# EAGLE design rs485board (EAGLE 7.6.0)
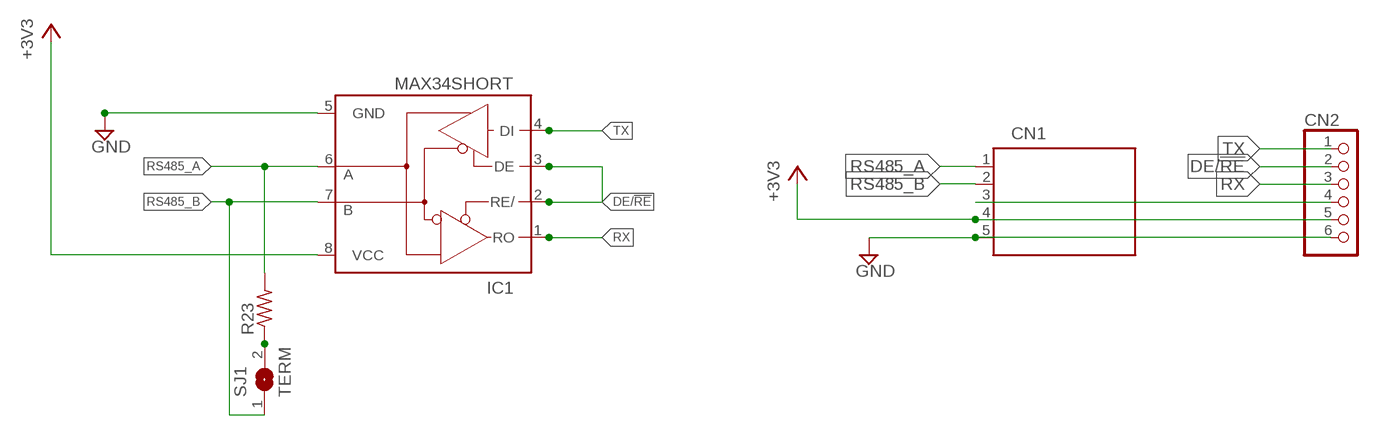
[diagram p0: schematic, sheet 1]

## Parts
CN1  5PINZH  [ZH-5]
CN2  PINHD-1X06_2.54  [1X06]
IC1  MAX34SHORT  [SO08SHORT]
R23  R-US_R0603  [R0603]
SJ1  TERM  SJ  [SJ]

## Nets
+3V3RS485: CN1.4 CN2.5 IC1.8(VCC) ; supply symbol labelled +3V3
DE/!RE: CN2.2 IC1.2(RE/) IC1.3(DE)
GND: CN1.5 CN2.6 IC1.5(GND)
N$44: R23.1 SJ1.2
N$45: CN1.3 CN2.4
RS485_A: CN1.1 IC1.6(A) R23.2
RS485_B: CN1.2 IC1.7(B) SJ1.1
RX: CN2.3 IC1.1(RO)
TX: CN2.1 IC1.4(DI)

## Library data of the parts
CN1 = con-jst:5PIN
CN2 = pinhead-2:PINHD-1X06: PIN HEADER
IC1 = maxim:MAX34*: +5V, Fail-Safe, 40Mbps, Profibus RS-485/RS-422 Transceivers Source: MAX3465-MAX3469.pdf
R23 = rcl:R-US_: RESISTOR, American symbol
SJ1 = jumper:SJ: SMD solder JUMPER

## Board
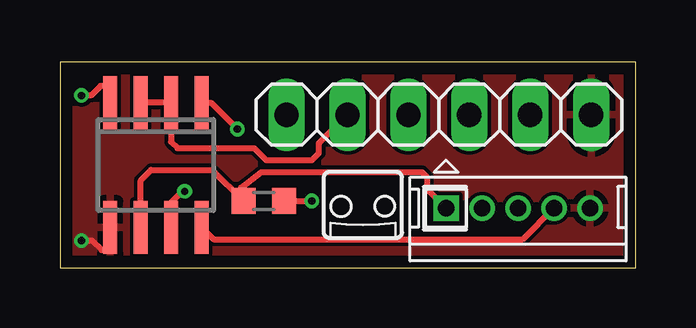
[diagram p1: board, top side]
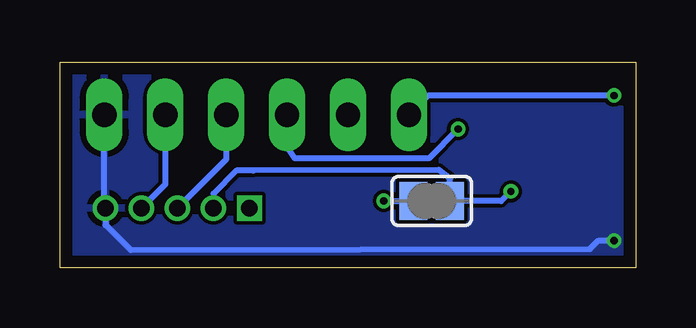
[diagram p2: board, bottom side, seen from below]

Size 24 x 8.6 mm. Coordinates in mm from the lower left corner, seen from the top.
Outline: 0,8.6 0,0 24,0 24,8.6 0,8.6
Copper layers (1*16): Top 0.035mm / dielectric 1.6mm / Bottom 0.035mm
Design rules "Elecrow_2-layer_PCB_eagle_rule": minimum track width 6mil, minimum drill 12mil, track to track 6mil, track to pad 6mil, pad to pad 6mil, via to via 8mil, smd to smd 0mil, copper to edge 20mil, drill to drill 10mil, minimum pad ring 6mil, minimum via ring 6mil, stop-mask expansion 0mil, vias tented up to drill 100mil, thermal gap 10mil

### Footprints (pad centres in the part's own frame; a part is rotated, then mirrored left to right if it is on the bottom)
ZH-5 = drill 0.7 square: 1 -4.5,0 | drill 0.7: 2 -3,0; 3 -1.5,0; 4 0,0; 5 1.5,0
1X06 = drill 1.016 long: 1 -6.35,0; 2 -3.81,0; 3 -1.27,0; 4 1.27,0; 5 3.81,0; 6 6.35,0
SO08SHORT = smd 0.6 x 2.2: 1 -1.905,-2.6; 2 -0.635,-2.6; 3 0.635,-2.6; 4 1.905,-2.6; 5 1.905,2.6; 6 0.635,2.6; 7 -0.635,2.6; 8 -1.905,2.6
R0603 = smd 1 x 1.1: 1 -0.85,0; 2 0.85,0
SJ = smd 1.168 x 1.6: 1 -0.762,0; 2 0.762,0

### Placement (x,y rotation side)
CN1  20.6,2.5 0 top
CN2  15.8,6.4 0 top
IC1  4,4.3 180 top
R23  8.5,2.8 180 top
SJ1  8.5,2.8 180 bottom
U$3  [PLENLOGO]  11,1.5 0 top

### Tracks (layer width: path | path; a pad name or v marks a point on that pad's centre or on a via)
+3V3RS485
  Top 0.254: CN1.4 19.3,1.2 6.41,1.2 IC1.8
  Bottom 0.254: CN2.5 19.61,3.49 CN1.4
DE/!RE
  Top 0.254: IC1.3 IC1.2 4.63,5.26 4.9,5 8.1,5 8.6,4.5 10.5,4.5 10.8,4.8 10.8,5.21 CN2.2
GND  (via drill 0.3)
  Top 0.254: v0.9,1.15 1.33,1.15 1.73,0.75 2.1,0.75 IC1.5
  Bottom 0.254: v0.9,1.15 1.55,1.15 1.9,0.8 21.05,0.75 22.1,1.8 CN1.5 22.15,2.5 CN2.6
  pour Top: 0,0 24,0 24,8.6 0,8.6
  pour Bottom: 0,0 24,0 24,8.6 0,8.6
N$44  (via drill 0.3)
  Top 0.254: R23.1 v10.5,2.8
  Bottom 0.254: v10.5,2.8 SJ1.2
N$45
  Bottom 0.254: CN2.4 17.07,4.53 CN1.3
RS485_A
  Top 0.254: IC1.6 3.37,3.67 3.8,4.1 6.35,4.1 R23.2 7.55,3.35 8.4,4 15.1,4 15.3,3.8 15.3,3.3 CN1.1
RS485_B  (via drill 0.3)
  Top 0.254: IC1.7 4.63,2.73 5.1,3.2 v5.2,3.2
  Bottom 0.254: v5.2,3.2 5.61,2.8 SJ1.1 7.74,3.74 8.2,4.1 15.94,4.06 16.64,4.06 17.6,3.1 CN1.2
RX  (via drill 0.3)
  Top 0.254: IC1.1 6.3,6.9 v7.4,5.8
  Bottom 0.254: v7.4,5.8 8.62,4.58 14.2,4.58 14.5,5 14.5,6.33 CN2.3
TX  (via drill 0.3)
  Top 0.254: IC1.4 2.1,7.59 1.7,7.59 1.3,7.2 v0.9,7.2
  Bottom 0.254: v0.9,7.2 8.65,7.2 CN2.1

### Text on the board
_tNames: C1 | C1 | R6 | R6 | R13 | R13 | R16 | R16 | R1 | R1 | U$1 | U$1 | R2 | R2 | R15 | R15 | R14 | R14 | R3 | R3 | J2 | J2 | R12 | R12 | R4 | R4 | J1 | J1 | C2 | C2 | C3 | C3 | R9 | R9 | R10 | R10 | R8 | R8 | R11 | R11 | R5 | R5